# Altium project DT_NEA_TRANSMITTER.PrjPcb
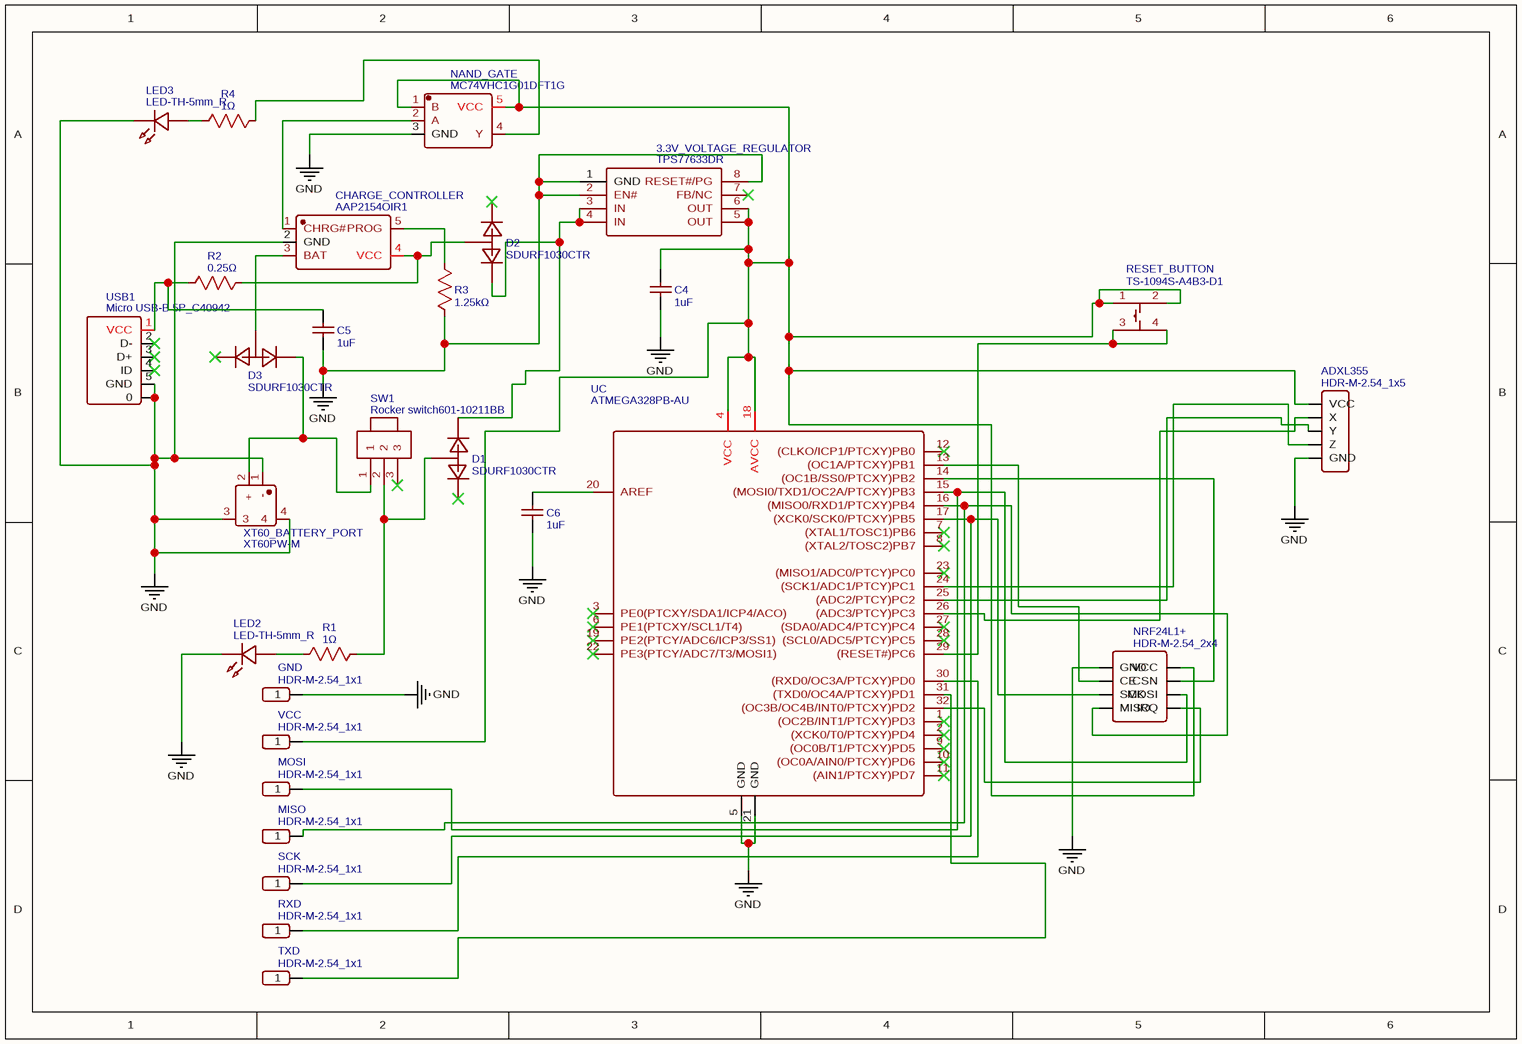
[diagram p0: Mk.2_2021-11-17.schdoc]
1 sheet, 29 parts. Net scope: global (net labels, ports and power ports of the same name join across sheets).
Board file: PCB_DTNEA-Z-AXIS-PRESS-MONITOR-TRANSMITTER_2021-11-17.pcbdoc

## Sheet Mk.2_2021-11-17.schdoc
size 284 x 194 mm

### Parts
3.3V_VOLTAGE_REGULATOR  TPS77633DR  [SOIC-8_L4.9-W3.9-P1.27-LS6.0-BL]
ADXL355  HDR-M-2.54_1x5  [HDR-M-2.54_1X5]
C4  1uF  [C0603]
C5  1uF  [C0603]
C6  1uF  [C0603]
CHARGE_CONTROLLER  AAP2154OIR1  [TSOT-23-5_L2.9-W1.6-P0.95-LS2.8-BL]
D1  SDURF1030CTR  [ITO-220AB-3_L10.2-W4.5-P2.60-L]
D2  SDURF1030CTR  [ITO-220AB-3_L10.2-W4.5-P2.60-L]
D3  SDURF1030CTR  [ITO-220AB-3_L10.2-W4.5-P2.60-L]
GND  HDR-M-2.54_1x1  [HDR-M-2.54_1X1]
LED2  LED-TH-5mm_R  [LED-TH_BD5.0_RED]
LED3  LED-TH-5mm_R  [LED-TH_BD5.0_RED]
MISO  HDR-M-2.54_1x1  [HDR-M-2.54_1X1]
MOSI  HDR-M-2.54_1x1  [HDR-M-2.54_1X1]
NAND_GATE  MC74VHC1G01DFT1G  [SOT-353_L2.0-W1.2-P0.65-LS2.1-TL]
NRF24L1+  HDR-M-2.54_2x4  [HDR-M-2.54_2X4]
R1  1Ω  [R0603]
R2  0.25Ω  [R0603]
R3  1.25kΩ  [R0603]
R4  1Ω  [R0603]
RESET_BUTTON  TS-1094S-A4B3-D1  [KEY-SMD_4P-L12.0-W12.0-P5.00-LS15.2]
RXD  HDR-M-2.54_1x1  [HDR-M-2.54_1X1]
SCK  HDR-M-2.54_1x1  [HDR-M-2.54_1X1]
SW1  Rocker switch601-10211BB  [SW-TH_601-10211BB]
TXD  HDR-M-2.54_1x1  [HDR-M-2.54_1X1]
UC  ATMEGA328PB-AU  [TQFP-32_L7.0-W7.0-P0.80-LS9.0-BL]
USB1  Micro USB-B 5P_C40942  [MICRO-USB-SMD_5P-P0.65-H-M_MICRO-USB-5P]
VCC  HDR-M-2.54_1x1  [HDR-M-2.54_1X1]
XT60_BATTERY_PORT  XT60PW-M  [CONN-TH_XT60PW-M]

### Nets
GND: 3.3V_VOLTAGE_REGULATOR.1(GND) 3.3V_VOLTAGE_REGULATOR.2(EN#) 3.3V_VOLTAGE_REGULATOR.8(RESET#/PG) ADXL355.5(GND) C4.2 C5.2 C6.2 CHARGE_CONTROLLER.2(GND) GND.1 LED2.2 LED3.2 NAND_GATE.3(GND) NRF24L1+.1(GND) R3.1 UC.5(GND) UC.21(GND) USB1.0 USB1.5(GND) XT60_BATTERY_PORT.1(-) XT60_BATTERY_PORT.3 XT60_BATTERY_PORT.4
Net3.3V_VOLTAGE_REGULATOR_3: 3.3V_VOLTAGE_REGULATOR.3(IN) 3.3V_VOLTAGE_REGULATOR.4(IN) D1.1(C) D2.3(C)
Net3.3V_VOLTAGE_REGULATOR_5: 3.3V_VOLTAGE_REGULATOR.5(OUT) 3.3V_VOLTAGE_REGULATOR.6(OUT) ADXL355.1(VCC) C4.1 NAND_GATE.1(B) NAND_GATE.5(VCC) NRF24L1+.2(VCC) RESET_BUTTON.1 RESET_BUTTON.2 UC.4(VCC) UC.18(AVCC) VCC.1
NetADXL355_2: ADXL355.2(X) UC.26((ADC3/PTCY)PC3)
NetADXL355_3: ADXL355.3(Y) UC.25((ADC2/PTCY)PC2)
NetADXL355_4: ADXL355.4(Z) UC.24((SCK1/ADC1/PTCY)PC1)
NetC5_1: C5.1 R2.1 USB1.1(VCC)
NetC6_1: C6.1 UC.20(AREF)
NetCHARGE_CONTROLLER_1: CHARGE_CONTROLLER.1(CHRG#) NAND_GATE.2(A)
NetCHARGE_CONTROLLER_3: CHARGE_CONTROLLER.3(BAT) D3.2(A)
NetCHARGE_CONTROLLER_4: CHARGE_CONTROLLER.4(VCC) D2.2(A) R2.2
NetCHARGE_CONTROLLER_5: CHARGE_CONTROLLER.5(PROG) R3.2
NetD1_2: D1.2(A) R1.2 SW1.2
NetD3_1: D3.1(C) SW1.1 XT60_BATTERY_PORT.2(+)
NetLED2_1: LED2.1 R1.1
NetLED3_1: LED3.1 R4.1
NetMISO_1: MISO.1 NRF24L1+.7(MISO) UC.16((MISO0/RXD1/PTCXY)PB4)
NetMOSI_1: MOSI.1 NRF24L1+.6(MOSI) UC.15((MOSI0/TXD1/OC2A/PTCXY)PB3)
NetNAND_GATE_4: NAND_GATE.4(Y) R4.2
NetNRF24L1+_3: NRF24L1+.3(CE) UC.13((OC1A/PTCXY)PB1)
NetNRF24L1+_4: NRF24L1+.4(CSN) UC.14((OC1B/SS0/PTCXY)PB2)
NetNRF24L1+_5: NRF24L1+.5(SCK) SCK.1 UC.17((XCK0/SCK0/PTCXY)PB5)
NetNRF24L1+_8: NRF24L1+.8(IRQ) UC.32((OC3B/OC4B/INT0/PTCXY)PD2)
NetRESET_BUTTON_3: RESET_BUTTON.3 RESET_BUTTON.4 UC.29((RESET#)PC6)
NetRXD_1: RXD.1 UC.30((RXD0/OC3A/PTCXY)PD0)
NetTXD_1: TXD.1 UC.31((TXD0/OC4A/PTCXY)PD1)

Not connected (* = marked no-connect by the designer): 3.3V_VOLTAGE_REGULATOR 7(FB/NC)*; D1 3(C)*; D2 1(C)*; D3 3(C)*; SW1 3*; UC 1((OC2B/INT1/PTCXY)PD3)* 2((XCK0/T0/PTCXY)PD4)* 3(PE0(PTCXY/SDA1/ICP4/ACO))* 6(PE1(PTCXY/SCL1/T4))* 7((XTAL1/TOSC1)PB6)* 8((XTAL2/TOSC2)PB7)* 9((OC0B/T1/PTCXY)PD5)* 10((OC0A/AIN0/PTCXY)PD6)* 11((AIN1/PTCXY)PD7)* 12((CLKO/ICP1/PTCXY)PB0)* 19(PE2(PTCY/ADC6/ICP3/SS1))* 22(PE3(PTCY/ADC7/T3/MOSI1))* 23((MISO1/ADC0/PTCY)PC0)* 27((SDA0/ADC4/PTCY)PC4)* 28((SCL0/ADC5/PTCY)PC5)*; USB1 2(D-)* 3(D+)* 4(ID)*

### Library data of the parts
3.3V_VOLTAGE_REGULATOR = TPS77633DR: BOM_Manufacturer: TI; BOM_Supplier: LCSC; BOM_Manufacturer Part: TPS77633DR; BOM_Supplier Part: C130078; BOM_JLCPCB Part Class: Extended Part; spicePre: U; spiceSymbolName: TPS77633DR
ADXL355 = HDR-M-2.54_1x5: Contributor: LCEDA_Lib; BOM_Supplier Part: C358687; BOM_Supplier: LCSC; spicePre: J; spiceSymbolName: HDR-M-2.54_1x5
C4-C6 = 1uF: BOM_Manufacturer: FH; BOM_Manufacturer Part: 0603F105M250NT; nameAlias: Capacitance; BOM_Supplier: LCSC; BOM_Supplier Part: C36577; BOM_JLCPCB Part Class: Extended Part; spicePre: C; spiceSymbolName: 0603F105M250NT
CHARGE_CONTROLLER = AAP2154OIR1: BOM_Manufacturer: Eutech Microelectronics; Contributor: LCSC; BOM_Supplier: LCSC; BOM_Supplier Part: C370749; BOM_Manufacturer Part: AAP2154OIR1; BOM_JLCPCB Part Class: Extended Part; spicePre: U; spiceSymbolName: AAP2154OIR1
D1-D3 = SDURF1030CTR: BOM_Manufacturer: Sangdest Microelectronicstronic (Nanjing); Contributor: LCSC; BOM_Supplier: LCSC; BOM_Supplier Part: C260371; BOM_Manufacturer Part: SDURF1030CTR; BOM_JLCPCB Part Class: Extended Part; spicePre: D; spiceSymbolName: SDURF1030CTR
GND MISO MOSI RXD SCK TXD VCC = HDR-M-2.54_1x1: Contributor: LCEDA_Lib; BOM_Supplier Part: C81276; BOM_Supplier: LCSC; spicePre: J; spiceSymbolName: HDR-M-2.54_1x1
LED2 LED3 = LED-TH-5mm_R: BOM_Manufacturer: EVERLIGHT(台湾亿光); BOM_Manufacturer Part: 333-2SURD/S530-A3; Contributor: LCEDA_Lib; BOM_Supplier Part: C87271; BOM_Supplier: LCSC; spicePre: L; spiceSymbolName: LED-TH-5mm_R
NAND_GATE = MC74VHC1G01DFT1G: BOM_Manufacturer: ON; Contributor: LCSC; BOM_Supplier: LCSC; BOM_Manufacturer Part: MC74VHC1G01DFT1G; BOM_Supplier Part: C150244; BOM_JLCPCB Part Class: Extended Part; spicePre: U; spiceSymbolName: MC74VHC1G01DFT1G
NRF24L1+ = HDR-M-2.54_2x4: Contributor: LCEDA_Lib; BOM_Supplier Part: C58363; BOM_Supplier: LCSC; spicePre: J; spiceSymbolName: HDR-M-2.54_2x4
R1 R4 = 1Ω: nameAlias: Value(Ω); Contributor: LCEDA_Lib; spicePre: R; spiceSymbolName: R_0603_US
R2 = 0.25Ω: nameAlias: Value(Ω); Contributor: LCEDA_Lib; spicePre: R; spiceSymbolName: R_0603_US
R3 = 1.25kΩ: nameAlias: Value(Ω); Contributor: LCEDA_Lib; spicePre: R; spiceSymbolName: R_0603_US
RESET_BUTTON = TS-1094S-A4B3-D1: BOM_Manufacturer: Yuandi; Contributor: LCSC; BOM_Supplier: LCSC; BOM_Supplier Part: C492972; BOM_Manufacturer Part: TS-1094S-A4B3-D1; BOM_JLCPCB Part Class: Extended Part; spicePre: S; spiceSymbolName: TS-1094S-A4B3-D1
SW1 = Rocker switch601-10211BB: BOM_Manufacturer: BBJ; BOM_Supplier: LCSC; BOM_Manufacturer Part: Rocker switch601-10211BB; BOM_Supplier Part: C67849; spicePre: S; spiceSymbolName: Rocker switch601-10211BB
UC = ATMEGA328PB-AU: BOM_Manufacturer: MICROCHIP; Contributor: LCSC; BOM_Supplier: LCSC; BOM_Manufacturer Part: ATMEGA328PB-AU; BOM_Supplier Part: C132230; BOM_JLCPCB Part Class: Extended Part; spicePre: U; spiceSymbolName: ATMEGA328PB-AU
USB1 = Micro USB-B 5P_C40942: BOM_Manufacturer: ValuePro; BOM_Supplier: LCSC; BOM_Manufacturer Part: Micro USB-B 5P_C40942; BOM_Supplier Part: C40942; BOM_JLCPCB Part Class: Extended Part; spicePre: U; spiceSymbolName: Micro USB-B 5P_C40942
XT60_BATTERY_PORT = XT60PW-M: BOM_Manufacturer: AMASS(艾迈斯); Contributor: LCSC; BOM_Supplier: LCSC; BOM_Supplier Part: C98732; BOM_Manufacturer Part: XT60PW-M; BOM_JLCPCB Part Class: Extended Part; spicePre: C; spiceSymbolName: XT60PW-M